# Altium schematic sheet Detection_Circuit_History.SchDoc: Object Detection PCB
size C; Date: 2018-FEB-03; Author: Nathan Schram; DrawnBy: Nathan Schram; Engineer: Nathan Schram; Revision: 1.0; SheetNumber: 1; SheetTotal: 2; DocumentName: Object Detection PCB; ProjectName: Augmented Reality Project
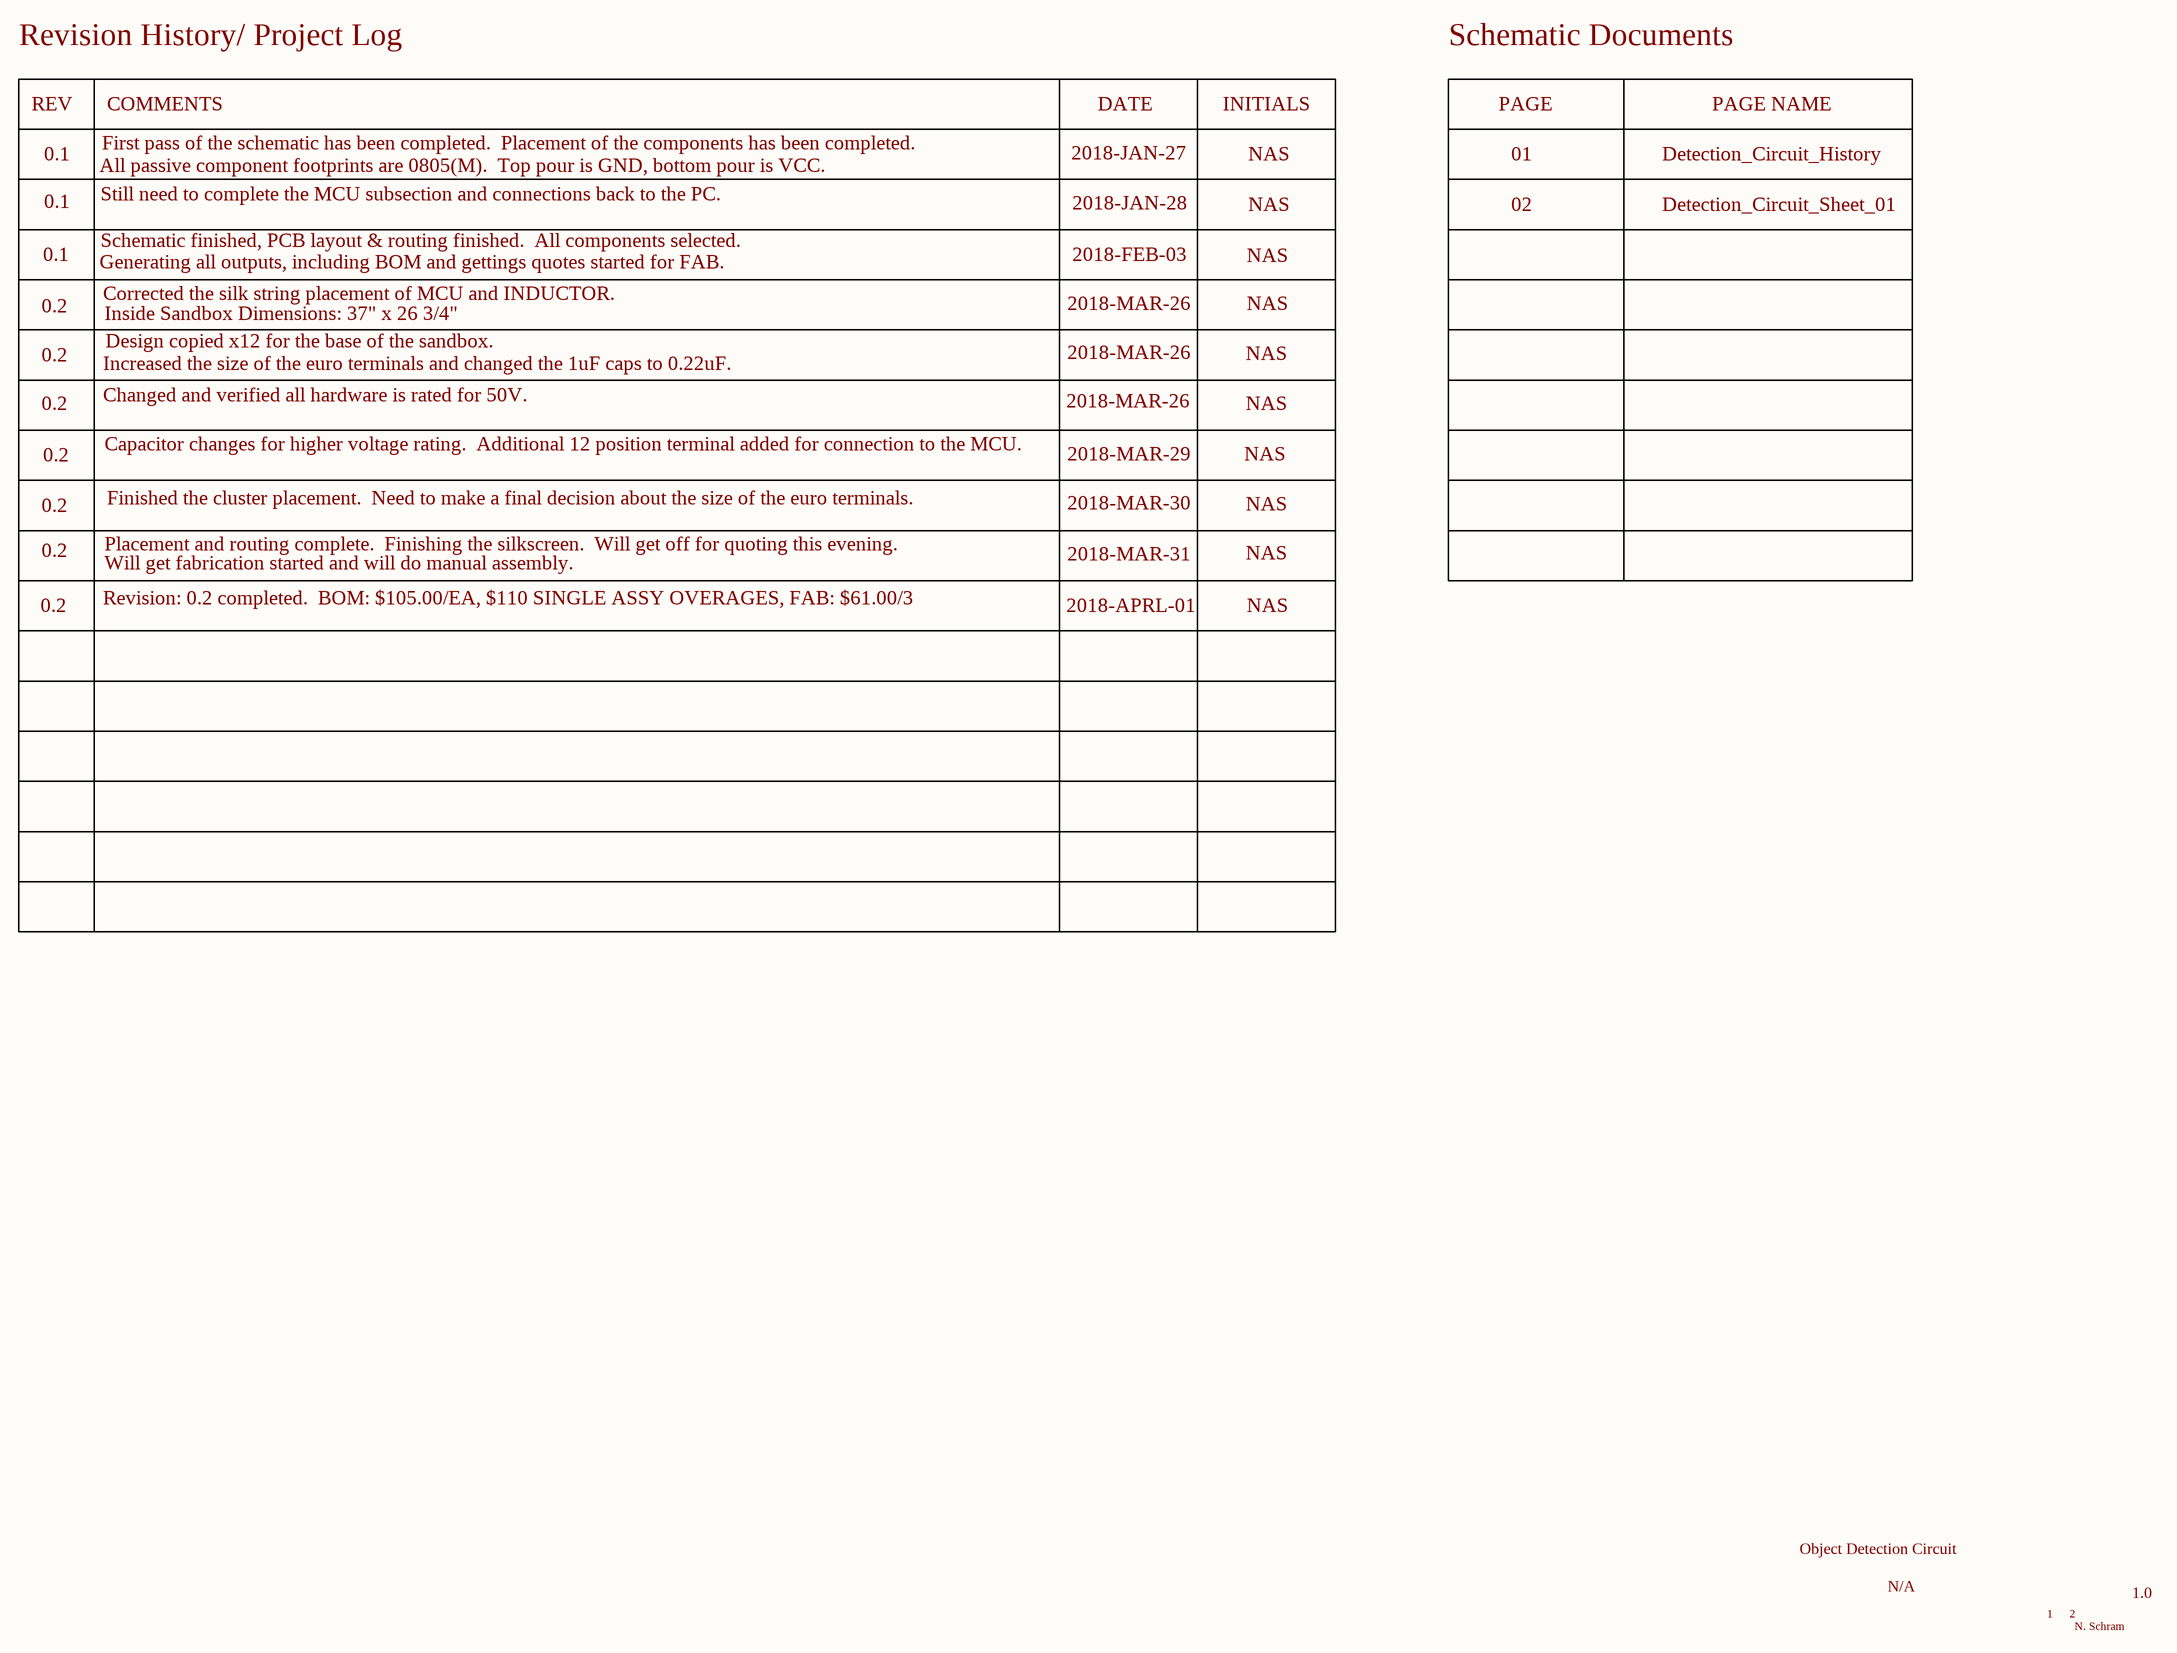
[diagram p0: Detection_Circuit_History.SchDoc]

## Notes on the sheet
- Revision History/ Project Log
- Schematic Documents
- REV
- COMMENTS
- DATE
- INITIALS
- PAGE
- PAGE NAME
- 0.1
- All passive component footprints are 0805(M).  Top pour is GND, bottom pour is VCC.
- First pass of the schematic has been completed.  Placement of the components has been completed.
- 2018-JAN-27
- NAS
- 01
- Detection_Circuit_History
- Still need to complete the MCU subsection and connections back to the PC.
- Schematic finished, PCB layout & routing finished.  All components selected.
- 2018-JAN-28
- 02
- Detection_Circuit_Sheet_01
- 0.2
- Generating all outputs, including BOM and gettings quotes started for FAB.
- Corrected the silk string placement of MCU and INDUCTOR.
- 2018-MAR-26
- 2018-FEB-03
- Increased the size of the euro terminals and changed the 1uF caps to 0.22uF.
- Inside Sandbox Dimensions: 37" x 26 3/4"
- Design copied x12 for the base of the sandbox.
- Changed and verified all hardware is rated for 50V.
- Capacitor changes for higher voltage rating.  Additional 12 position terminal added for connection to the MCU.
- Finished the cluster placement.  Need to make a final decision about the size of the euro terminals.
- 2018-MAR-29
- Placement and routing complete.  Finishing the silkscreen.  Will get off for quoting this evening.
- 2018-MAR-30
- 2018-MAR-31
- Revision: 0.2 completed.  BOM: $105.00/EA, $110 SINGLE ASSY OVERAGES, FAB: $61.00/3
- Will get fabrication started and will do manual assembly.
- 2018-APRL-01
- Object Detection Circuit
- N/A
- 1
- 2
- N. Schram
- 1.0